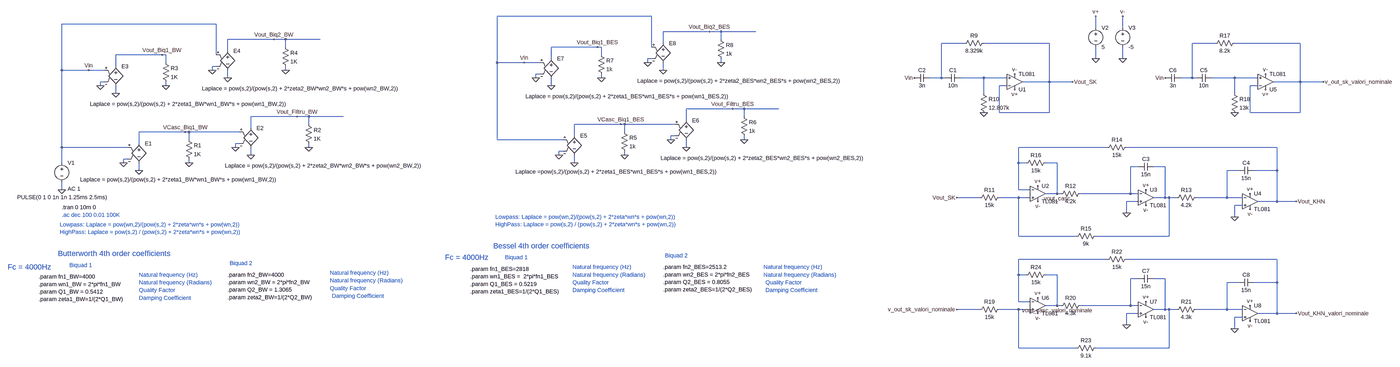
[diagram p0: schematic Proiect_Scia_Lihet_Ioan_Vlad_ltspice.asc, whole sheet]
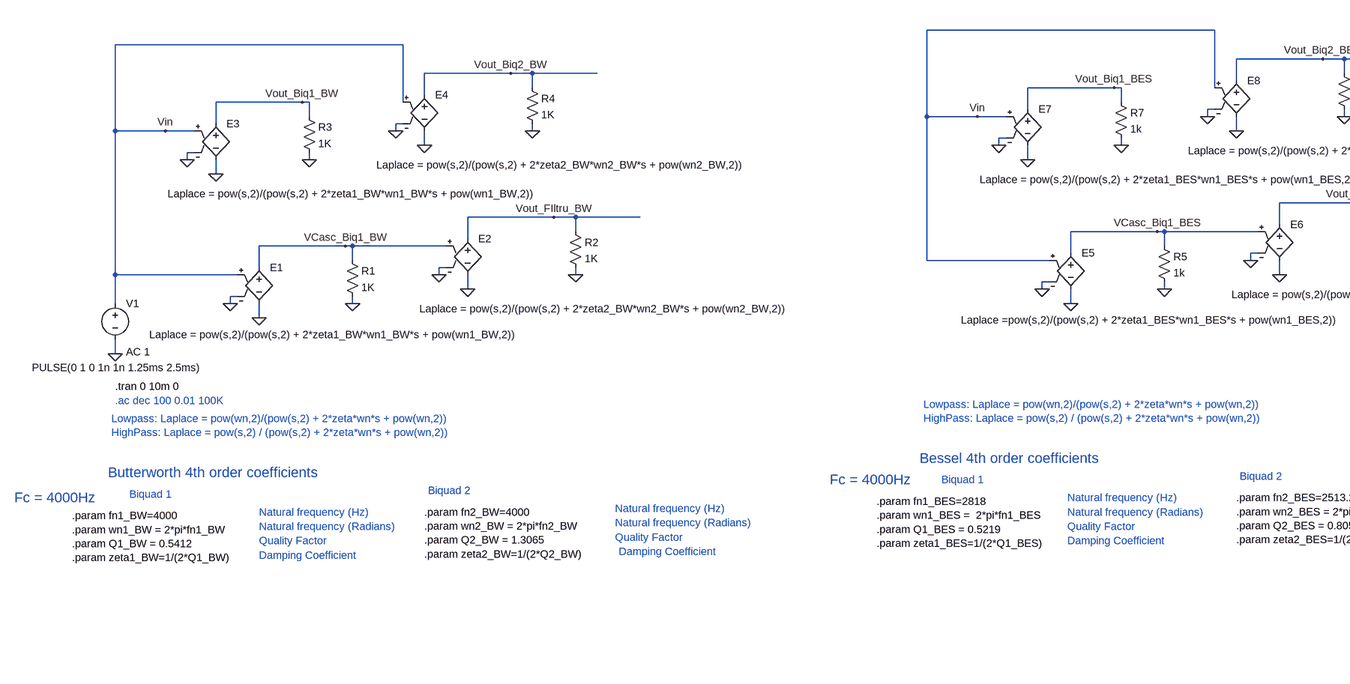
[diagram p1: schematic Proiect_Scia_Lihet_Ioan_Vlad_ltspice.asc, part, row 1 of 1, column 1 of 2]
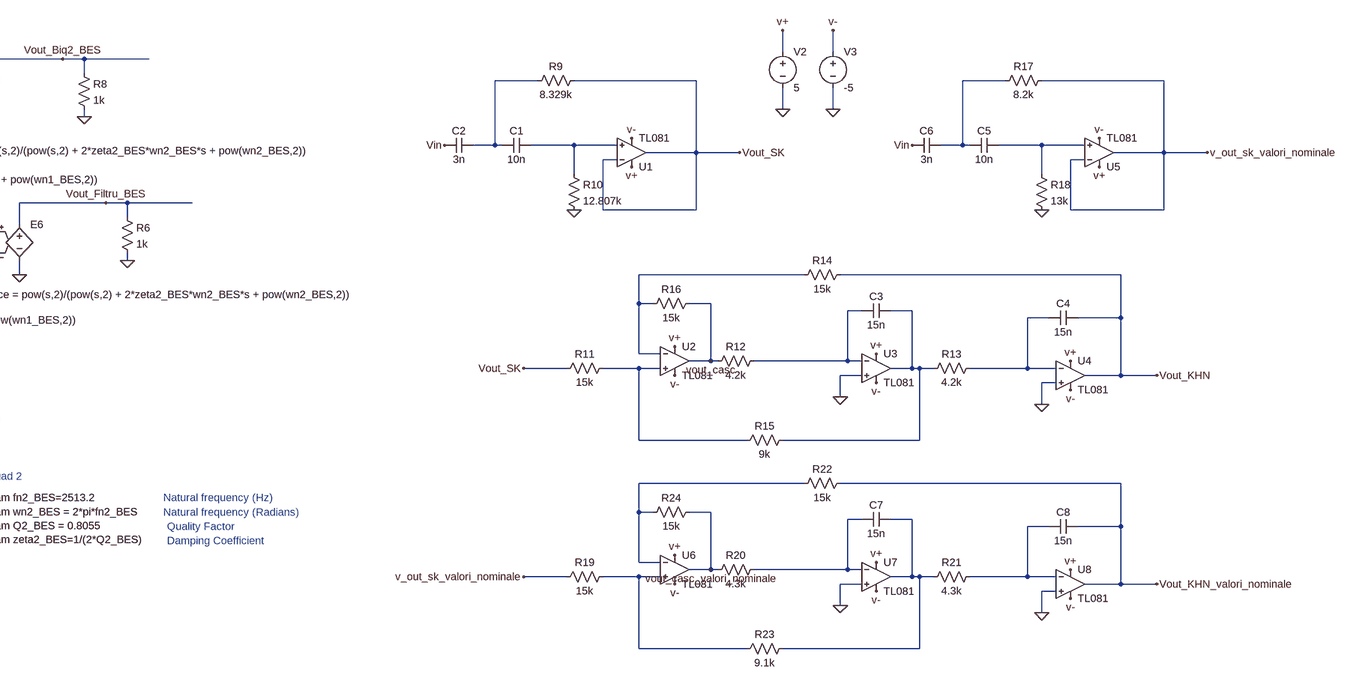
[diagram p2: schematic Proiect_Scia_Lihet_Ioan_Vlad_ltspice.asc, part, row 1 of 1, column 2 of 2]
Proiect_Scia_Lihet_Ioan_Vlad_ltspice.asc, the LTspice schematic file:
Version 4
SHEET 1 5700 928
WIRE 2464 -496 1824 -496
WIRE 592 -464 -48 -464
WIRE 4432 -448 4432 -496
WIRE 4544 -448 4544 -496
WIRE 2704 -432 2512 -432
WIRE 2752 -432 2704 -432
WIRE 2896 -432 2752 -432
WIRE 832 -400 640 -400
WIRE 880 -400 832 -400
WIRE 1024 -400 880 -400
WIRE 2752 -400 2752 -432
WIRE 2512 -384 2512 -432
WIRE 3888 -384 3792 -384
WIRE 4240 -384 3968 -384
WIRE 4928 -384 4832 -384
WIRE 5280 -384 5008 -384
WIRE 880 -368 880 -400
WIRE 2240 -368 2048 -368
WIRE 2256 -368 2240 -368
WIRE 2464 -368 2464 -496
WIRE 640 -352 640 -400
WIRE 368 -336 176 -336
WIRE 384 -336 368 -336
WIRE 592 -336 592 -464
WIRE 2256 -336 2256 -368
WIRE 2048 -320 2048 -368
WIRE 2464 -320 2448 -320
WIRE 4432 -320 4432 -368
WIRE 4544 -320 4544 -368
WIRE 384 -304 384 -336
WIRE 1824 -304 1824 -496
WIRE 1936 -304 1824 -304
WIRE 2000 -304 1936 -304
WIRE 2448 -304 2448 -320
WIRE 2752 -304 2752 -320
WIRE 176 -288 176 -336
WIRE 592 -288 576 -288
WIRE -48 -272 -48 -464
WIRE 64 -272 -48 -272
WIRE 128 -272 64 -272
WIRE 576 -272 576 -288
WIRE 880 -272 880 -288
WIRE 2512 -272 2512 -304
WIRE 2000 -256 1984 -256
WIRE 640 -240 640 -272
WIRE 1984 -240 1984 -256
WIRE 2256 -240 2256 -256
WIRE 3792 -240 3792 -384
WIRE 3792 -240 3744 -240
WIRE 3808 -240 3792 -240
WIRE 3968 -240 3872 -240
WIRE 4064 -240 3968 -240
WIRE 4832 -240 4832 -384
WIRE 4832 -240 4784 -240
WIRE 4848 -240 4832 -240
WIRE 5008 -240 4912 -240
WIRE 5104 -240 5008 -240
WIRE 128 -224 112 -224
WIRE 4240 -224 4240 -384
WIRE 4240 -224 4128 -224
WIRE 4336 -224 4240 -224
WIRE 5280 -224 5280 -384
WIRE 5280 -224 5168 -224
WIRE 5376 -224 5280 -224
WIRE 112 -208 112 -224
WIRE 384 -208 384 -224
WIRE 2048 -208 2048 -240
WIRE 4064 -208 4032 -208
WIRE 5104 -208 5072 -208
WIRE 176 -176 176 -208
WIRE 3968 -176 3968 -240
WIRE 5008 -176 5008 -240
WIRE 2800 -112 2608 -112
WIRE 2848 -112 2800 -112
WIRE 2992 -112 2848 -112
WIRE 4032 -96 4032 -208
WIRE 4240 -96 4240 -224
WIRE 4240 -96 4032 -96
WIRE 5072 -96 5072 -208
WIRE 5280 -96 5280 -224
WIRE 5280 -96 5072 -96
WIRE 928 -80 736 -80
WIRE 976 -80 928 -80
WIRE 1120 -80 976 -80
WIRE 2848 -80 2848 -112
WIRE 2608 -64 2608 -112
WIRE 976 -48 976 -80
WIRE 2336 -48 2144 -48
WIRE 2352 -48 2336 -48
WIRE 2560 -48 2352 -48
WIRE 736 -32 736 -80
WIRE 464 -16 272 -16
WIRE 480 -16 464 -16
WIRE 688 -16 480 -16
WIRE 2352 -16 2352 -48
WIRE 2144 0 2144 -48
WIRE 2560 0 2544 0
WIRE 480 16 480 -16
WIRE 1824 16 1824 -304
WIRE 2096 16 1824 16
WIRE 2544 16 2544 0
WIRE 2848 16 2848 0
WIRE 272 32 272 -16
WIRE 688 32 672 32
WIRE -48 48 -48 -272
WIRE 224 48 -48 48
WIRE 672 48 672 32
WIRE 976 48 976 32
WIRE 2608 48 2608 16
WIRE 4480 48 4112 48
WIRE 5184 48 4560 48
WIRE 2096 64 2080 64
WIRE 736 80 736 48
WIRE 2080 80 2080 64
WIRE 2352 80 2352 64
WIRE 224 96 208 96
WIRE -48 112 -48 48
WIRE 208 112 208 96
WIRE 480 112 480 96
WIRE 2144 112 2144 80
WIRE 4112 112 4112 48
WIRE 4144 112 4112 112
WIRE 4272 112 4224 112
WIRE 4608 128 4576 128
WIRE 4720 128 4672 128
WIRE 272 144 272 112
WIRE 5024 144 4976 144
WIRE 5184 144 5184 48
WIRE 5184 144 5088 144
WIRE -48 224 -48 192
WIRE 4112 224 4112 112
WIRE 4160 224 4112 224
WIRE 4272 240 4272 112
WIRE 4272 240 4224 240
WIRE 4288 240 4272 240
WIRE 4576 240 4576 128
WIRE 4576 240 4368 240
WIRE 4608 240 4576 240
WIRE 3952 256 3856 256
WIRE 4112 256 4032 256
WIRE 4160 256 4112 256
WIRE 4720 256 4720 128
WIRE 4720 256 4672 256
WIRE 4736 256 4720 256
WIRE 4768 256 4736 256
WIRE 4976 256 4976 144
WIRE 4976 256 4848 256
WIRE 5040 256 4976 256
WIRE 4608 272 4560 272
WIRE 5184 272 5184 144
WIRE 5184 272 5104 272
WIRE 5264 272 5184 272
WIRE 5040 288 5008 288
WIRE 4560 320 4560 272
WIRE 5008 336 5008 288
WIRE 4112 416 4112 256
WIRE 4352 416 4112 416
WIRE 4736 416 4736 256
WIRE 4736 416 4432 416
WIRE 4480 512 4112 512
WIRE 5184 512 4560 512
WIRE 4112 576 4112 512
WIRE 4144 576 4112 576
WIRE 4272 576 4224 576
WIRE 4608 592 4576 592
WIRE 4720 592 4672 592
WIRE 5024 608 4976 608
WIRE 5184 608 5184 512
WIRE 5184 608 5088 608
WIRE 4112 688 4112 576
WIRE 4160 688 4112 688
WIRE 4272 704 4272 576
WIRE 4272 704 4224 704
WIRE 4288 704 4272 704
WIRE 4576 704 4576 592
WIRE 4576 704 4368 704
WIRE 4608 704 4576 704
WIRE 3952 720 3856 720
WIRE 4112 720 4032 720
WIRE 4160 720 4112 720
WIRE 4720 720 4720 592
WIRE 4720 720 4672 720
WIRE 4736 720 4720 720
WIRE 4768 720 4736 720
WIRE 4976 720 4976 608
WIRE 4976 720 4848 720
WIRE 5040 720 4976 720
WIRE 4608 736 4560 736
WIRE 5184 736 5184 608
WIRE 5184 736 5104 736
WIRE 5264 736 5184 736
WIRE 5040 752 5008 752
WIRE 4560 784 4560 736
WIRE 5008 800 5008 752
WIRE 4112 880 4112 720
WIRE 4352 880 4112 880
WIRE 4736 880 4736 720
WIRE 4736 880 4432 880
FLAG -48 224 0
FLAG 208 112 0
FLAG 272 144 0
FLAG 464 -16 VCasc_Biq1_BW
FLAG 672 48 0
FLAG 736 80 0
FLAG 928 -80 Vout_FIltru_BW
FLAG 480 112 0
FLAG 976 48 0
FLAG 64 -272 Vin
FLAG 112 -208 0
FLAG 176 -176 0
FLAG 368 -336 Vout_Biq1_BW
FLAG 576 -272 0
FLAG 640 -240 0
FLAG 832 -400 Vout_Biq2_BW
FLAG 384 -208 0
FLAG 880 -272 0
FLAG 2080 80 0
FLAG 2144 112 0
FLAG 2336 -48 VCasc_Biq1_BES
FLAG 2544 16 0
FLAG 2608 48 0
FLAG 2800 -112 Vout_Filtru_BES
FLAG 2352 80 0
FLAG 2848 16 0
FLAG 1936 -304 Vin
FLAG 1984 -240 0
FLAG 2048 -208 0
FLAG 2240 -368 Vout_Biq1_BES
FLAG 2448 -304 0
FLAG 2512 -272 0
FLAG 2704 -432 Vout_Biq2_BES
FLAG 2256 -240 0
FLAG 2752 -304 0
FLAG 4432 -320 0
FLAG 4544 -320 0
FLAG 4432 -496 v+
FLAG 4544 -496 v-
FLAG 4096 -256 v-
FLAG 4096 -192 v+
FLAG 3680 -240 Vin
FLAG 4336 -224 Vout_SK
FLAG 3968 -96 0
FLAG 4560 320 0
FLAG 5008 336 0
FLAG 4192 208 v+
FLAG 4640 224 v+
FLAG 5072 240 v+
FLAG 4192 272 v-
FLAG 4640 288 v-
FLAG 5072 304 v-
FLAG 5264 272 Vout_KHN
FLAG 4272 240 vout_casc
FLAG 3856 256 Vout_SK
FLAG 5136 -256 v-
FLAG 5136 -192 v+
FLAG 4720 -240 Vin
FLAG 5008 -96 0
FLAG 5376 -224 v_out_sk_valori_nominale
FLAG 4560 784 0
FLAG 5008 800 0
FLAG 4192 672 v+
FLAG 4640 688 v+
FLAG 5072 704 v+
FLAG 4192 736 v-
FLAG 4640 752 v-
FLAG 5072 768 v-
FLAG 5264 736 Vout_KHN_valori_nominale
FLAG 4272 704 vout_casc_valori_nominale
FLAG 3856 720 v_out_sk_valori_nominale
SYMBOL voltage -48 96 R0
WINDOW 123 24 124 Left 2
WINDOW 39 0 0 Left 2
WINDOW 3 -185 159 Left 2
SYMATTR Value2 AC 1
SYMATTR Value PULSE(0 1 0 1n 1n 1.25ms 2.5ms)
SYMATTR InstName V1
SYMBOL e 272 16 R0
WINDOW 3 -244 165 Left 2
SYMATTR Value Laplace = pow(s,2)/(pow(s,2) + 2*zeta1_BW*wn1_BW*s + pow(wn1_BW,2))
SYMATTR InstName E1
SYMBOL e 736 -48 R0
WINDOW 3 -107 172 Left 2
SYMATTR Value Laplace = pow(s,2)/(pow(s,2) + 2*zeta2_BW*wn2_BW*s + pow(wn2_BW,2))
SYMATTR InstName E2
SYMBOL res 464 0 R0
SYMATTR InstName R1
SYMATTR Value 1K
SYMBOL res 960 -64 R0
SYMATTR InstName R2
SYMATTR Value 1K
SYMBOL e 176 -304 R0
WINDOW 3 -107 172 Left 2
SYMATTR Value Laplace = pow(s,2)/(pow(s,2) + 2*zeta1_BW*wn1_BW*s + pow(wn1_BW,2))
SYMATTR InstName E3
SYMBOL e 640 -368 R0
WINDOW 3 -107 172 Left 2
SYMATTR Value Laplace = pow(s,2)/(pow(s,2) + 2*zeta2_BW*wn2_BW*s + pow(wn2_BW,2))
SYMATTR InstName E4
SYMBOL res 368 -320 R0
SYMATTR InstName R3
SYMATTR Value 1K
SYMBOL res 864 -384 R0
SYMATTR InstName R4
SYMATTR Value 1K
SYMBOL e 2144 -16 R0
WINDOW 3 -244 165 Left 2
SYMATTR Value Laplace =pow(s,2)/(pow(s,2) + 2*zeta1_BES*wn1_BES*s + pow(wn1_BES,2))
SYMATTR InstName E5
SYMBOL e 2608 -80 R0
WINDOW 3 -107 172 Left 2
SYMATTR Value Laplace = pow(s,2)/(pow(s,2) + 2*zeta2_BES*wn2_BES*s + pow(wn2_BES,2))
SYMATTR InstName E6
SYMBOL res 2336 -32 R0
SYMATTR InstName R5
SYMATTR Value 1k
SYMBOL res 2832 -96 R0
SYMATTR InstName R6
SYMATTR Value 1k
SYMBOL e 2048 -336 R0
WINDOW 3 -107 172 Left 2
SYMATTR Value Laplace = pow(s,2)/(pow(s,2) + 2*zeta1_BES*wn1_BES*s + pow(wn1_BES,2))
SYMATTR InstName E7
SYMBOL e 2512 -400 R0
WINDOW 3 -107 172 Left 2
SYMATTR Value Laplace = pow(s,2)/(pow(s,2) + 2*zeta2_BES*wn2_BES*s + pow(wn2_BES,2))
SYMATTR InstName E8
SYMBOL res 2240 -352 R0
SYMATTR InstName R7
SYMATTR Value 1k
SYMBOL res 2736 -416 R0
SYMATTR InstName R8
SYMATTR Value 1k
SYMBOL res 3984 -400 R90
WINDOW 0 0 56 VBottom 2
WINDOW 3 32 56 VTop 2
SYMATTR InstName R9
SYMATTR Value 8.329k
SYMBOL cap 3872 -256 R90
WINDOW 0 0 32 VBottom 2
WINDOW 3 32 32 VTop 2
SYMATTR InstName C1
SYMATTR Value 10n
SYMBOL cap 3744 -256 R90
WINDOW 0 0 32 VBottom 2
WINDOW 3 32 32 VTop 2
SYMATTR InstName C2
SYMATTR Value 3n
SYMBOL res 3952 -192 R0
SYMATTR InstName R10
SYMATTR Value 12.807k
SYMBOL voltage 4432 -464 R0
SYMATTR InstName V2
SYMATTR Value 5
SYMBOL voltage 4544 -464 R0
SYMATTR InstName V3
SYMATTR Value -5
SYMBOL TL081 4096 -160 M180
SYMATTR InstName U1
SYMBOL TL081 4192 176 R0
SYMATTR InstName U2
SYMBOL TL081 4640 192 R0
SYMATTR InstName U3
SYMBOL TL081 5072 208 R0
SYMATTR InstName U4
SYMBOL res 4048 240 R90
WINDOW 0 0 56 VBottom 2
WINDOW 3 32 56 VTop 2
SYMATTR InstName R11
SYMATTR Value 15k
SYMBOL res 4384 224 R90
WINDOW 0 0 56 VBottom 2
WINDOW 3 32 56 VTop 2
SYMATTR InstName R12
SYMATTR Value 4.2k
SYMBOL res 4864 240 R90
WINDOW 0 0 56 VBottom 2
WINDOW 3 32 56 VTop 2
SYMATTR InstName R13
SYMATTR Value 4.2k
SYMBOL res 4576 32 R90
WINDOW 0 0 56 VBottom 2
WINDOW 3 32 56 VTop 2
SYMATTR InstName R14
SYMATTR Value 15k
SYMBOL res 4448 400 R90
WINDOW 0 0 56 VBottom 2
WINDOW 3 32 56 VTop 2
SYMATTR InstName R15
SYMATTR Value 9k
SYMBOL res 4240 96 R90
WINDOW 0 0 56 VBottom 2
WINDOW 3 32 56 VTop 2
SYMATTR InstName R16
SYMATTR Value 15k
SYMBOL cap 4672 112 R90
WINDOW 0 0 32 VBottom 2
WINDOW 3 32 32 VTop 2
SYMATTR InstName C3
SYMATTR Value 15n
SYMBOL cap 5088 128 R90
WINDOW 0 0 32 VBottom 2
WINDOW 3 32 32 VTop 2
SYMATTR InstName C4
SYMATTR Value 15n
SYMBOL res 5024 -400 R90
WINDOW 0 0 56 VBottom 2
WINDOW 3 32 56 VTop 2
SYMATTR InstName R17
SYMATTR Value 8.2k
SYMBOL cap 4912 -256 R90
WINDOW 0 0 32 VBottom 2
WINDOW 3 32 32 VTop 2
SYMATTR InstName C5
SYMATTR Value 10n
SYMBOL cap 4784 -256 R90
WINDOW 0 0 32 VBottom 2
WINDOW 3 32 32 VTop 2
SYMATTR InstName C6
SYMATTR Value 3n
SYMBOL res 4992 -192 R0
SYMATTR InstName R18
SYMATTR Value 13k
SYMBOL TL081 5136 -160 M180
SYMATTR InstName U5
SYMBOL TL081 4192 640 R0
SYMATTR InstName U6
SYMBOL TL081 4640 656 R0
SYMATTR InstName U7
SYMBOL TL081 5072 672 R0
SYMATTR InstName U8
SYMBOL res 4048 704 R90
WINDOW 0 0 56 VBottom 2
WINDOW 3 32 56 VTop 2
SYMATTR InstName R19
SYMATTR Value 15k
SYMBOL res 4384 688 R90
WINDOW 0 0 56 VBottom 2
WINDOW 3 32 56 VTop 2
SYMATTR InstName R20
SYMATTR Value 4.3k
SYMBOL res 4864 704 R90
WINDOW 0 0 56 VBottom 2
WINDOW 3 32 56 VTop 2
SYMATTR InstName R21
SYMATTR Value 4.3k
SYMBOL res 4576 496 R90
WINDOW 0 0 56 VBottom 2
WINDOW 3 32 56 VTop 2
SYMATTR InstName R22
SYMATTR Value 15k
SYMBOL res 4448 864 R90
WINDOW 0 0 56 VBottom 2
WINDOW 3 32 56 VTop 2
SYMATTR InstName R23
SYMATTR Value 9.1k
SYMBOL res 4240 560 R90
WINDOW 0 0 56 VBottom 2
WINDOW 3 32 56 VTop 2
SYMATTR InstName R24
SYMATTR Value 15k
SYMBOL cap 4672 576 R90
WINDOW 0 0 32 VBottom 2
WINDOW 3 32 32 VTop 2
SYMATTR InstName C7
SYMATTR Value 15n
SYMBOL cap 5088 592 R90
WINDOW 0 0 32 VBottom 2
WINDOW 3 32 32 VTop 2
SYMATTR InstName C8
SYMATTR Value 15n
TEXT -144 584 Left 2 !.param fn1_BW=4000\n.param wn1_BW = 2*pi*fn1_BW\n.param Q1_BW = 0.5412\n.param zeta1_BW=1/(2*Q1_BW)
TEXT -48 328 Left 2 ;.ac dec 100 0.01 100K
TEXT 272 576 Left 2 ;Natural frequency (Hz)
TEXT 272 608 Left 2 ;Natural frequency (Radians)
TEXT 272 672 Left 2 ;Damping Coefficient
TEXT -16 536 Left 2 ;Biquad 1
TEXT -56 368 Left 2 ;Lowpass: Laplace = pow(wn,2)/(pow(s,2) + 2*zeta*wn*s + pow(wn,2))\nHighPass: Laplace = pow(s,2) / (pow(s,2) + 2*zeta*wn*s + pow(wn,2))
TEXT 640 576 Left 2 !.param fn2_BW=4000\n.param wn2_BW = 2*pi*fn2_BW\n.param Q2_BW = 1.3065\n.param zeta2_BW=1/(2*Q2_BW)
TEXT 1064 568 Left 2 ;Natural frequency (Hz)
TEXT 1064 600 Left 2 ;Natural frequency (Radians)
TEXT 1072 664 Left 2 ;Damping Coefficient
TEXT 272 640 Left 2 ;Quality Factor
TEXT 1064 632 Left 2 ;Quality Factor
TEXT -64 488 Left 3 ;Butterworth 4th order coefficients
TEXT 648 528 Left 2 ;Biquad 2
TEXT 1712 552 Left 2 !.param fn1_BES=2818\n.param wn1_BES =  2*pi*fn1_BES\n.param Q1_BES = 0.5219\n.param zeta1_BES=1/(2*Q1_BES)
TEXT 2136 544 Left 2 ;Natural frequency (Hz)
TEXT 2136 576 Left 2 ;Natural frequency (Radians)
TEXT 2136 640 Left 2 ;Damping Coefficient
TEXT 1856 504 Left 2 ;Biquad 1
TEXT 1816 336 Left 2 ;Lowpass: Laplace = pow(wn,2)/(pow(s,2) + 2*zeta*wn*s + pow(wn,2))\nHighPass: Laplace = pow(s,2) / (pow(s,2) + 2*zeta*wn*s + pow(wn,2))
TEXT 2512 544 Left 2 !.param fn2_BES=2513.2\n.param wn2_BES = 2*pi*fn2_BES\n.param Q2_BES = 0.8055\n.param zeta2_BES=1/(2*Q2_BES)
TEXT 2928 544 Left 2 ;Natural frequency (Hz)
TEXT 2928 576 Left 2 ;Natural frequency (Radians)
TEXT 2936 640 Left 2 ;Damping Coefficient
TEXT 2136 608 Left 2 ;Quality Factor
TEXT 2936 608 Left 2 ;Quality Factor
TEXT 1808 456 Left 3 ;Bessel 4th order coefficients
TEXT 2520 496 Left 2 ;Biquad 2
TEXT 1608 504 Left 3 ;Fc = 4000Hz
TEXT -272 544 Left 3 ;Fc = 4000Hz
TEXT -48 296 Left 2 !.tran 0 10m 0

The netlist it stands for:
* Proiect_Scia_Lihet_Ioan_Vlad_ltspice.asc
V1 Vin 0 PULSE(0 1 0 1n 1n 1.25ms 2.5ms) AC 1
E1 VCasc_Biq1_BW 0 Vin 0 Laplace = pow(s,2)/(pow(s,2) + 2*zeta1_BW*wn1_BW*s + pow(wn1_BW,2))
E2 Vout_FIltru_BW 0 VCasc_Biq1_BW 0 Laplace = pow(s,2)/(pow(s,2) + 2*zeta2_BW*wn2_BW*s + pow(wn2_BW,2))
R1 VCasc_Biq1_BW 0 1K
R2 Vout_FIltru_BW 0 1K
E3 Vout_Biq1_BW 0 Vin 0 Laplace = pow(s,2)/(pow(s,2) + 2*zeta1_BW*wn1_BW*s + pow(wn1_BW,2))
E4 Vout_Biq2_BW 0 Vin 0 Laplace = pow(s,2)/(pow(s,2) + 2*zeta2_BW*wn2_BW*s + pow(wn2_BW,2))
R3 Vout_Biq1_BW 0 1K
R4 Vout_Biq2_BW 0 1K
E5 VCasc_Biq1_BES 0 Vin 0 Laplace =pow(s,2)/(pow(s,2) + 2*zeta1_BES*wn1_BES*s + pow(wn1_BES,2))
E6 Vout_Filtru_BES 0 VCasc_Biq1_BES 0 Laplace = pow(s,2)/(pow(s,2) + 2*zeta2_BES*wn2_BES*s + pow(wn2_BES,2))
R5 VCasc_Biq1_BES 0 1k
R6 Vout_Filtru_BES 0 1k
E7 Vout_Biq1_BES 0 Vin 0 Laplace = pow(s,2)/(pow(s,2) + 2*zeta1_BES*wn1_BES*s + pow(wn1_BES,2))
E8 Vout_Biq2_BES 0 Vin 0 Laplace = pow(s,2)/(pow(s,2) + 2*zeta2_BES*wn2_BES*s + pow(wn2_BES,2))
R7 Vout_Biq1_BES 0 1k
R8 Vout_Biq2_BES 0 1k
R9 Vout_SK N001 8.329k
C1 N003 N001 10n
C2 N001 Vin 3n
R10 N003 0 12.807k
V2 v+ 0 5
V3 v- 0 -5
* U1: TL081 (symbol TL081 not available, pins judged from their places): In+=N003 In-=Vout_SK V+=v+ V-=v- OUT=Vout_SK
* U2: TL081 (symbol TL081 not available, pins judged from their places): In+=N009 In-=N005 V+=v+ V-=v- OUT=vout_casc
* U3: TL081 (symbol TL081 not available, pins judged from their places): In+=0 In-=N006 V+=v+ V-=v- OUT=N007
* U4: TL081 (symbol TL081 not available, pins judged from their places): In+=0 In-=N008 V+=v+ V-=v- OUT=Vout_KHN
R11 N009 Vout_SK 15k
R12 N006 vout_casc 4.2k
R13 N008 N007 4.2k
R14 Vout_KHN N005 15k
R15 N007 N009 9k
R16 vout_casc N005 15k
C3 N007 N006 15n
C4 Vout_KHN N008 15n
R17 v_out_sk_valori_nominale N002 8.2k
C5 N004 N002 10n
C6 N002 Vin 3n
R18 N004 0 13k
* U5: TL081 (symbol TL081 not available, pins judged from their places): In+=N004 In-=v_out_sk_valori_nominale V+=v+ V-=v- OUT=v_out_sk_valori_nominale
* U6: TL081 (symbol TL081 not available, pins judged from their places): In+=N014 In-=N010 V+=v+ V-=v- OUT=vout_casc_valori_nominale
* U7: TL081 (symbol TL081 not available, pins judged from their places): In+=0 In-=N011 V+=v+ V-=v- OUT=N012
* U8: TL081 (symbol TL081 not available, pins judged from their places): In+=0 In-=N013 V+=v+ V-=v- OUT=Vout_KHN_valori_nominale
R19 N014 v_out_sk_valori_nominale 15k
R20 N011 vout_casc_valori_nominale 4.3k
R21 N013 N012 4.3k
R22 Vout_KHN_valori_nominale N010 15k
R23 N012 N014 9.1k
R24 vout_casc_valori_nominale N010 15k
C7 N012 N011 15n
C8 Vout_KHN_valori_nominale N013 15n
.param fn1_BW=4000
.param wn1_BW = 2*pi*fn1_BW
.param Q1_BW = 0.5412
.param zeta1_BW=1/(2*Q1_BW)
* .ac dec 100 0.01 100K
* Natural frequency (Hz)
* Natural frequency (Radians)
* Damping Coefficient
* Biquad 1
* Lowpass: Laplace = pow(wn,2)/(pow(s,2) + 2*zeta*wn*s + pow(wn,2))
* HighPass: Laplace = pow(s,2) / (pow(s,2) + 2*zeta*wn*s + pow(wn,2))
.param fn2_BW=4000
.param wn2_BW = 2*pi*fn2_BW
.param Q2_BW = 1.3065
.param zeta2_BW=1/(2*Q2_BW)
* Natural frequency (Hz)
* Natural frequency (Radians)
* Damping Coefficient
* Quality Factor
* Quality Factor
* Butterworth 4th order coefficients
* Biquad 2
.param fn1_BES=2818
.param wn1_BES =  2*pi*fn1_BES
.param Q1_BES = 0.5219
.param zeta1_BES=1/(2*Q1_BES)
* Natural frequency (Hz)
* Natural frequency (Radians)
* Damping Coefficient
* Biquad 1
* Lowpass: Laplace = pow(wn,2)/(pow(s,2) + 2*zeta*wn*s + pow(wn,2))
* HighPass: Laplace = pow(s,2) / (pow(s,2) + 2*zeta*wn*s + pow(wn,2))
.param fn2_BES=2513.2
.param wn2_BES = 2*pi*fn2_BES
.param Q2_BES = 0.8055
.param zeta2_BES=1/(2*Q2_BES)
* Natural frequency (Hz)
* Natural frequency (Radians)
* Damping Coefficient
* Quality Factor
* Quality Factor
* Bessel 4th order coefficients
* Biquad 2
* Fc = 4000Hz
* Fc = 4000Hz
.tran 0 10m 0
.backanno
.end